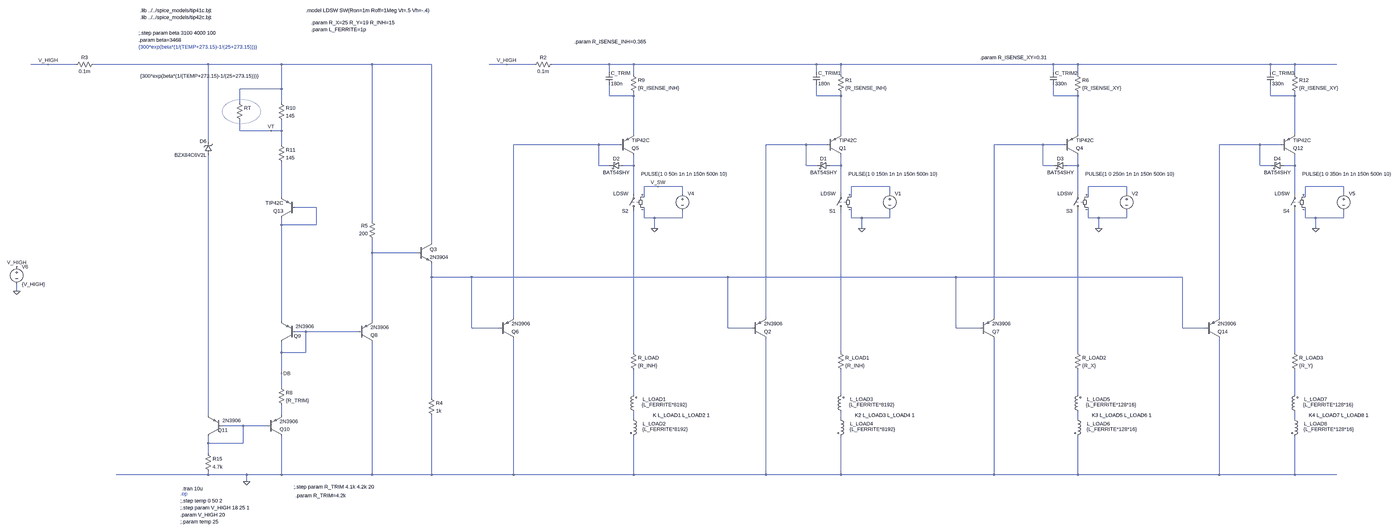
[diagram p0: schematic current_source.asc, whole sheet]
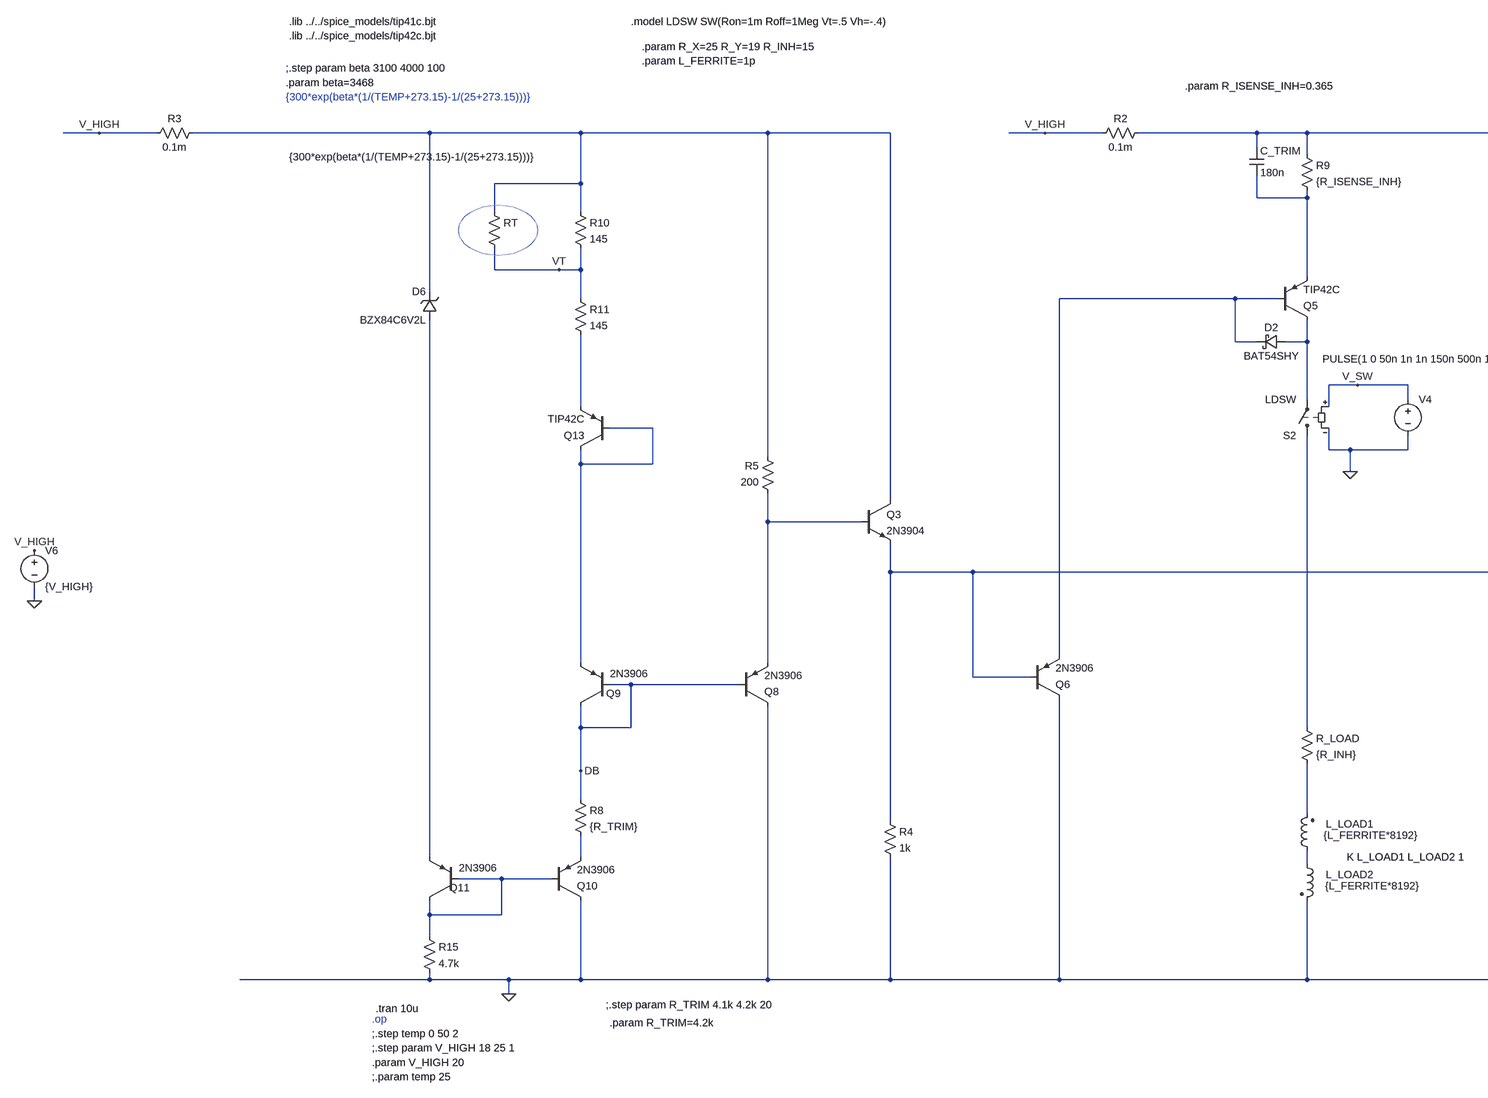
[diagram p1: schematic current_source.asc, part, row 1 of 1, column 1 of 2]
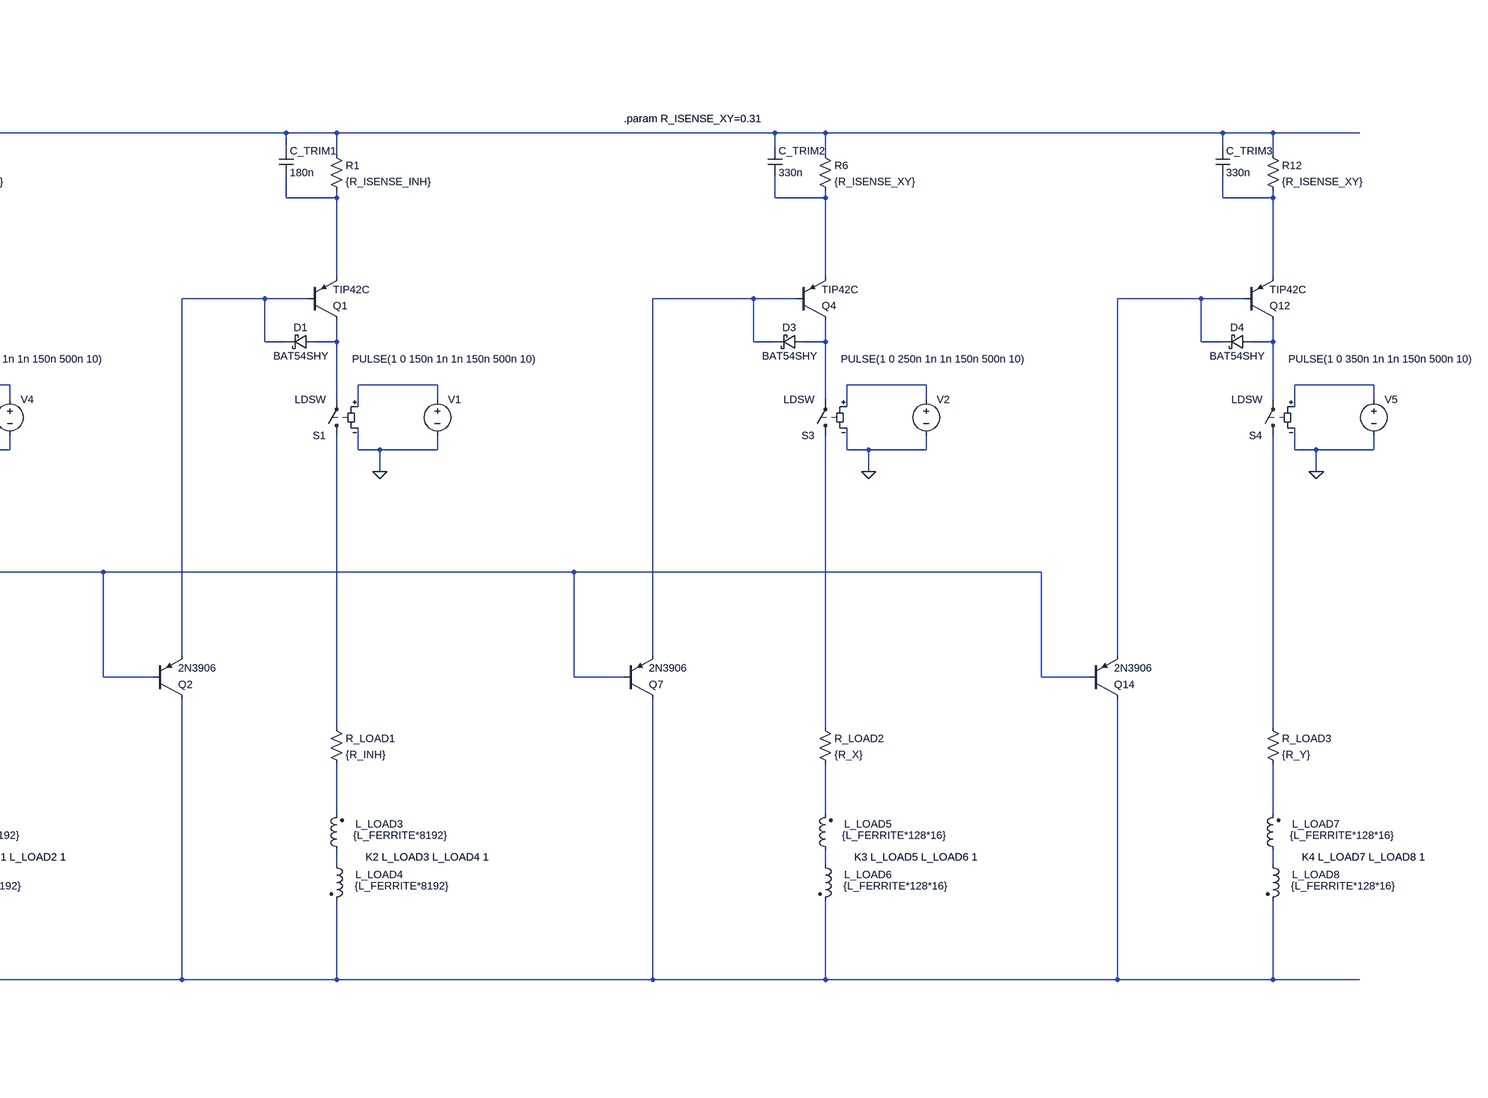
[diagram p2: schematic current_source.asc, part, row 1 of 1, column 2 of 2]
current_source.asc, the LTspice schematic file:
Version 4.1
SHEET 1 5384 1216
WIRE -1088 -3552 -1168 -3552
WIRE -960 -3552 -1088 -3552
WIRE -320 -3552 -880 -3552
WIRE 16 -3552 -320 -3552
WIRE 432 -3552 16 -3552
WIRE 704 -3552 432 -3552
WIRE 1088 -3552 1008 -3552
WIRE 1216 -3552 1088 -3552
WIRE 1584 -3552 1296 -3552
WIRE 1696 -3552 1584 -3552
WIRE 2608 -3552 1696 -3552
WIRE 2720 -3552 2608 -3552
WIRE 3728 -3552 2720 -3552
WIRE 3840 -3552 3728 -3552
WIRE 4800 -3552 3840 -3552
WIRE 4912 -3552 4800 -3552
WIRE 5104 -3552 4912 -3552
WIRE 1584 -3520 1584 -3552
WIRE 2608 -3520 2608 -3552
WIRE 3728 -3520 3728 -3552
WIRE 4800 -3520 4800 -3552
WIRE 1696 -3504 1696 -3552
WIRE 2720 -3504 2720 -3552
WIRE 3840 -3504 3840 -3552
WIRE 4912 -3504 4912 -3552
WIRE 16 -3440 16 -3552
WIRE 16 -3440 -176 -3440
WIRE 1584 -3408 1584 -3456
WIRE 1696 -3408 1696 -3424
WIRE 1696 -3408 1584 -3408
WIRE 2608 -3408 2608 -3456
WIRE 2720 -3408 2720 -3424
WIRE 2720 -3408 2608 -3408
WIRE 3728 -3408 3728 -3456
WIRE 3840 -3408 3840 -3424
WIRE 3840 -3408 3728 -3408
WIRE 4800 -3408 4800 -3456
WIRE 4912 -3408 4912 -3424
WIRE 4912 -3408 4800 -3408
WIRE -176 -3376 -176 -3440
WIRE 16 -3376 16 -3440
WIRE -176 -3248 -176 -3296
WIRE -32 -3248 -176 -3248
WIRE 16 -3248 16 -3296
WIRE 16 -3248 -32 -3248
WIRE 1696 -3232 1696 -3408
WIRE 2720 -3232 2720 -3408
WIRE 3840 -3232 3840 -3408
WIRE 4912 -3232 4912 -3408
WIRE -320 -3200 -320 -3552
WIRE 16 -3184 16 -3248
WIRE 1536 -3184 1120 -3184
WIRE 1632 -3184 1536 -3184
WIRE 2560 -3184 2336 -3184
WIRE 2656 -3184 2560 -3184
WIRE 3680 -3184 3456 -3184
WIRE 3776 -3184 3680 -3184
WIRE 4752 -3184 4528 -3184
WIRE 4848 -3184 4752 -3184
WIRE 1536 -3088 1536 -3184
WIRE 1584 -3088 1536 -3088
WIRE 1696 -3088 1696 -3136
WIRE 1696 -3088 1648 -3088
WIRE 2560 -3088 2560 -3184
WIRE 2608 -3088 2560 -3088
WIRE 2720 -3088 2720 -3136
WIRE 2720 -3088 2672 -3088
WIRE 3680 -3088 3680 -3184
WIRE 3728 -3088 3680 -3088
WIRE 3840 -3088 3840 -3136
WIRE 3840 -3088 3792 -3088
WIRE 4752 -3088 4752 -3184
WIRE 4800 -3088 4752 -3088
WIRE 4912 -3088 4912 -3136
WIRE 4912 -3088 4864 -3088
WIRE 1808 -2992 1744 -2992
WIRE 1920 -2992 1808 -2992
WIRE 2944 -2992 2768 -2992
WIRE 4064 -2992 3888 -2992
WIRE 5136 -2992 4960 -2992
WIRE 1696 -2960 1696 -3088
WIRE 1920 -2960 1920 -2992
WIRE 2720 -2960 2720 -3088
WIRE 2944 -2960 2944 -2992
WIRE 3840 -2960 3840 -3088
WIRE 4064 -2960 4064 -2992
WIRE 4912 -2960 4912 -3088
WIRE 5136 -2960 5136 -2992
WIRE 16 -2944 16 -3104
WIRE 1744 -2944 1744 -2992
WIRE 2768 -2944 2768 -2992
WIRE 3888 -2944 3888 -2992
WIRE 4960 -2944 4960 -2992
WIRE 176 -2896 80 -2896
WIRE 1744 -2848 1744 -2896
WIRE 1792 -2848 1744 -2848
WIRE 1920 -2848 1920 -2880
WIRE 1920 -2848 1792 -2848
WIRE 2768 -2848 2768 -2896
WIRE 2816 -2848 2768 -2848
WIRE 2944 -2848 2944 -2880
WIRE 2944 -2848 2816 -2848
WIRE 3888 -2848 3888 -2896
WIRE 3936 -2848 3888 -2848
WIRE 4064 -2848 4064 -2880
WIRE 4064 -2848 3936 -2848
WIRE 4960 -2848 4960 -2896
WIRE 5008 -2848 4960 -2848
WIRE 5136 -2848 5136 -2880
WIRE 5136 -2848 5008 -2848
WIRE 432 -2832 432 -3552
WIRE 16 -2816 16 -2848
WIRE 176 -2816 176 -2896
WIRE 176 -2816 16 -2816
WIRE 1792 -2800 1792 -2848
WIRE 2816 -2800 2816 -2848
WIRE 3936 -2800 3936 -2848
WIRE 5008 -2800 5008 -2848
WIRE 704 -2736 704 -3552
WIRE 432 -2688 432 -2752
WIRE 640 -2688 432 -2688
WIRE 704 -2576 704 -2640
WIRE 928 -2576 704 -2576
WIRE 2128 -2576 928 -2576
WIRE 3248 -2576 2128 -2576
WIRE 4320 -2576 3248 -2576
WIRE -1232 -2512 -1232 -2544
WIRE 1120 -2304 1120 -3184
WIRE 2336 -2304 2336 -3184
WIRE 3456 -2304 3456 -3184
WIRE 4528 -2304 4528 -3184
WIRE 16 -2288 16 -2816
WIRE 432 -2288 432 -2688
WIRE 928 -2256 928 -2576
WIRE 1056 -2256 928 -2256
WIRE 2128 -2256 2128 -2576
WIRE 2272 -2256 2128 -2256
WIRE 3248 -2256 3248 -2576
WIRE 3392 -2256 3248 -2256
WIRE 4320 -2256 4320 -2576
WIRE 4464 -2256 4320 -2256
WIRE 128 -2240 80 -2240
WIRE 368 -2240 128 -2240
WIRE 16 -2144 16 -2192
WIRE 128 -2144 128 -2240
WIRE 128 -2144 16 -2144
WIRE 1696 -2144 1696 -2880
WIRE 2720 -2144 2720 -2880
WIRE 3840 -2144 3840 -2880
WIRE 4912 -2144 4912 -2880
WIRE 16 -2048 16 -2144
WIRE 16 -1984 16 -2048
WIRE 1696 -1952 1696 -2064
WIRE 2720 -1952 2720 -2064
WIRE 3840 -1952 3840 -2064
WIRE 4912 -1952 4912 -2064
WIRE 704 -1936 704 -2576
WIRE -320 -1856 -320 -3136
WIRE 16 -1856 16 -1904
WIRE 1696 -1840 1696 -1872
WIRE 2720 -1840 2720 -1872
WIRE 3840 -1840 3840 -1872
WIRE 4912 -1840 4912 -1872
WIRE -160 -1808 -256 -1808
WIRE -48 -1808 -160 -1808
WIRE -320 -1728 -320 -1760
WIRE -160 -1728 -160 -1808
WIRE -160 -1728 -320 -1728
WIRE -320 -1680 -320 -1728
WIRE -320 -1584 -320 -1600
WIRE -320 -1584 -752 -1584
WIRE -144 -1584 -320 -1584
WIRE 16 -1584 16 -1760
WIRE 16 -1584 -144 -1584
WIRE 432 -1584 432 -2192
WIRE 432 -1584 16 -1584
WIRE 704 -1584 704 -1856
WIRE 704 -1584 432 -1584
WIRE 1120 -1584 1120 -2208
WIRE 1120 -1584 704 -1584
WIRE 1696 -1584 1696 -1760
WIRE 1696 -1584 1120 -1584
WIRE 2336 -1584 2336 -2208
WIRE 2336 -1584 1696 -1584
WIRE 2720 -1584 2720 -1760
WIRE 2720 -1584 2336 -1584
WIRE 3456 -1584 3456 -2208
WIRE 3456 -1584 2720 -1584
WIRE 3840 -1584 3840 -1760
WIRE 3840 -1584 3456 -1584
WIRE 4528 -1584 4528 -2208
WIRE 4528 -1584 3840 -1584
WIRE 4912 -1584 4912 -1760
WIRE 4912 -1584 4528 -1584
WIRE 5104 -1584 4912 -1584
WIRE -144 -1552 -144 -1584
FLAG -144 -1552 0
FLAG -32 -3248 VT
FLAG 16 -2048 DB
FLAG 1792 -2800 0
FLAG 1808 -2992 V_SW
FLAG 2816 -2800 0
FLAG 3936 -2800 0
FLAG 5008 -2800 0
FLAG 1088 -3552 V_HIGH
FLAG -1088 -3552 V_HIGH
FLAG -1232 -2512 0
FLAG -1232 -2624 V_HIGH
SYMBOL res 0 -2000 R0
SYMATTR InstName R8
SYMATTR Value {R_TRIM}
SYMBOL res 1680 -3520 R0
SYMATTR InstName R9
SYMATTR Value {R_ISENSE_INH}
SYMBOL pnp 1632 -3136 M180
SYMATTR InstName Q5
SYMATTR Value TIP42C
SYMBOL pnp 368 -2192 M180
SYMATTR InstName Q8
SYMATTR Value 2N3906
SYMBOL pnp 80 -2192 R180
WINDOW 0 -25 28 Left 2
WINDOW 3 -86 72 Left 2
SYMATTR InstName Q9
SYMATTR Value 2N3906
SYMBOL res 0 -3392 R0
SYMATTR InstName R10
SYMATTR Value 145
SYMBOL res 0 -3200 R0
SYMATTR InstName R11
SYMATTR Value 145
SYMBOL res -192 -3392 R0
WINDOW 3 -440 -107 Left 2
SYMATTR Value {300*exp(beta*(1/(TEMP+273.15)-1/(25+273.15)))}
SYMATTR InstName RT
SYMBOL schottky 1648 -3104 R90
WINDOW 0 0 32 VBottom 2
WINDOW 3 32 32 VTop 2
SYMATTR InstName D2
SYMATTR Value BAT54SHY
SYMATTR Description Diode
SYMATTR Type diode
SYMBOL cap 1568 -3520 R0
SYMATTR InstName C_TRIM
SYMATTR Value 180n
SYMBOL zener -304 -3136 R180
WINDOW 0 24 64 Left 2
WINDOW 3 24 0 Left 2
SYMATTR InstName D6
SYMATTR Value BZX84C6V2L
SYMBOL res -336 -1696 R0
SYMATTR InstName R15
SYMATTR Value 4.7k
SYMBOL pnp -48 -1760 M180
SYMATTR InstName Q10
SYMATTR Value 2N3906
SYMBOL pnp -256 -1760 R180
WINDOW 0 -25 28 Left 2
WINDOW 3 -86 72 Left 2
SYMATTR InstName Q11
SYMATTR Value 2N3906
SYMBOL sw 1696 -2864 R180
SYMATTR InstName S2
SYMATTR Value LDSW
SYMBOL voltage 1920 -2976 R0
WINDOW 123 0 0 Left 0
WINDOW 39 0 0 Left 0
WINDOW 3 -190 -74 Left 2
SYMATTR Value PULSE(1 0 50n 1n 1n 150n 500n 10)
SYMATTR InstName V4
SYMBOL res 1680 -2160 R0
SYMATTR InstName R_LOAD
SYMATTR Value {R_INH}
SYMBOL ind2 1712 -1856 R180
WINDOW 0 -26 74 Right 2
WINDOW 3 -21 49 Right 2
SYMATTR InstName L_LOAD1
SYMATTR Value {L_FERRITE*8192}
SYMATTR Type ind
SYMBOL ind2 1680 -1856 R0
WINDOW 0 58 39 Left 2
WINDOW 3 56 64 Left 2
SYMATTR InstName L_LOAD2
SYMATTR Value {L_FERRITE*8192}
SYMATTR Type ind
SYMBOL res 2704 -3520 R0
SYMATTR InstName R1
SYMATTR Value {R_ISENSE_INH}
SYMBOL pnp 2656 -3136 M180
SYMATTR InstName Q1
SYMATTR Value TIP42C
SYMBOL pnp 2272 -2208 M180
SYMATTR InstName Q2
SYMATTR Value 2N3906
SYMBOL schottky 2672 -3104 R90
WINDOW 0 0 32 VBottom 2
WINDOW 3 32 32 VTop 2
SYMATTR InstName D1
SYMATTR Value BAT54SHY
SYMATTR Description Diode
SYMATTR Type diode
SYMBOL cap 2592 -3520 R0
SYMATTR InstName C_TRIM1
SYMATTR Value 180n
SYMBOL sw 2720 -2864 R180
SYMATTR InstName S1
SYMATTR Value LDSW
SYMBOL voltage 2944 -2976 R0
WINDOW 123 0 0 Left 0
WINDOW 39 0 0 Left 0
WINDOW 3 -190 -74 Left 2
SYMATTR Value PULSE(1 0 150n 1n 1n 150n 500n 10)
SYMATTR InstName V1
SYMBOL res 2704 -2160 R0
SYMATTR InstName R_LOAD1
SYMATTR Value {R_INH}
SYMBOL ind2 2736 -1856 R180
WINDOW 0 -26 74 Right 2
WINDOW 3 -21 49 Right 2
SYMATTR InstName L_LOAD3
SYMATTR Value {L_FERRITE*8192}
SYMATTR Type ind
SYMBOL ind2 2704 -1856 R0
WINDOW 0 58 39 Left 2
WINDOW 3 56 64 Left 2
SYMATTR InstName L_LOAD4
SYMATTR Value {L_FERRITE*8192}
SYMATTR Type ind
SYMBOL npn 640 -2736 R0
SYMATTR InstName Q3
SYMATTR Value 2N3904
SYMBOL pnp 1056 -2208 M180
SYMATTR InstName Q6
SYMATTR Value 2N3906
SYMBOL res 688 -1952 R0
SYMATTR InstName R4
SYMATTR Value 1k
SYMBOL pnp 80 -2848 R180
SYMATTR InstName Q13
SYMATTR Value TIP42C
SYMBOL res 448 -2736 R180
WINDOW 0 36 76 Left 2
WINDOW 3 36 40 Left 2
SYMATTR InstName R5
SYMATTR Value 200
SYMBOL res 3824 -3520 R0
SYMATTR InstName R6
SYMATTR Value {R_ISENSE_XY}
SYMBOL pnp 3776 -3136 M180
SYMATTR InstName Q4
SYMATTR Value TIP42C
SYMBOL pnp 3392 -2208 M180
SYMATTR InstName Q7
SYMATTR Value 2N3906
SYMBOL schottky 3792 -3104 R90
WINDOW 0 0 32 VBottom 2
WINDOW 3 32 32 VTop 2
SYMATTR InstName D3
SYMATTR Value BAT54SHY
SYMATTR Description Diode
SYMATTR Type diode
SYMBOL cap 3712 -3520 R0
SYMATTR InstName C_TRIM2
SYMATTR Value 330n
SYMBOL sw 3840 -2864 R180
SYMATTR InstName S3
SYMATTR Value LDSW
SYMBOL voltage 4064 -2976 R0
WINDOW 123 0 0 Left 0
WINDOW 39 0 0 Left 0
WINDOW 3 -190 -74 Left 2
SYMATTR Value PULSE(1 0 250n 1n 1n 150n 500n 10)
SYMATTR InstName V2
SYMBOL res 3824 -2160 R0
SYMATTR InstName R_LOAD2
SYMATTR Value {R_X}
SYMBOL ind2 3856 -1856 R180
WINDOW 0 -26 74 Right 2
WINDOW 3 -21 49 Right 2
SYMATTR InstName L_LOAD5
SYMATTR Value {L_FERRITE*128*16}
SYMATTR Type ind
SYMBOL ind2 3824 -1856 R0
WINDOW 0 58 39 Left 2
WINDOW 3 56 64 Left 2
SYMATTR InstName L_LOAD6
SYMATTR Value {L_FERRITE*128*16}
SYMATTR Type ind
SYMBOL res 4896 -3520 R0
SYMATTR InstName R12
SYMATTR Value {R_ISENSE_XY}
SYMBOL pnp 4848 -3136 M180
SYMATTR InstName Q12
SYMATTR Value TIP42C
SYMBOL pnp 4464 -2208 M180
SYMATTR InstName Q14
SYMATTR Value 2N3906
SYMBOL schottky 4864 -3104 R90
WINDOW 0 0 32 VBottom 2
WINDOW 3 32 32 VTop 2
SYMATTR InstName D4
SYMATTR Value BAT54SHY
SYMATTR Description Diode
SYMATTR Type diode
SYMBOL cap 4784 -3520 R0
SYMATTR InstName C_TRIM3
SYMATTR Value 330n
SYMBOL sw 4912 -2864 R180
SYMATTR InstName S4
SYMATTR Value LDSW
SYMBOL voltage 5136 -2976 R0
WINDOW 123 0 0 Left 0
WINDOW 39 0 0 Left 0
WINDOW 3 -190 -74 Left 2
SYMATTR Value PULSE(1 0 350n 1n 1n 150n 500n 10)
SYMATTR InstName V5
SYMBOL res 4896 -2160 R0
SYMATTR InstName R_LOAD3
SYMATTR Value {R_Y}
SYMBOL ind2 4928 -1856 R180
WINDOW 0 -26 74 Right 2
WINDOW 3 -21 49 Right 2
SYMATTR InstName L_LOAD7
SYMATTR Value {L_FERRITE*128*16}
SYMATTR Type ind
SYMBOL ind2 4896 -1856 R0
WINDOW 0 58 39 Left 2
WINDOW 3 56 64 Left 2
SYMATTR InstName L_LOAD8
SYMATTR Value {L_FERRITE*128*16}
SYMATTR Type ind
SYMBOL res 1200 -3536 R270
WINDOW 0 32 56 VTop 2
WINDOW 3 0 56 VBottom 2
SYMATTR InstName R2
SYMATTR Value 0.1m
SYMBOL res -976 -3536 R270
WINDOW 0 32 56 VTop 2
WINDOW 3 0 56 VBottom 2
SYMATTR InstName R3
SYMATTR Value 0.1m
SYMBOL voltage -1232 -2640 R0
SYMATTR InstName V6
SYMATTR Value {V_HIGH}
TEXT -632 -3768 Left 2 !.lib ../../spice_models/tip42c.bjt
TEXT -632 -3800 Left 2 !.lib ../../spice_models/tip41c.bjt
TEXT -448 -1464 Left 2 !;.step temp 0 50 2
TEXT -448 -1496 Left 2 ;.op
TEXT -448 -1432 Left 2 !;.step param V_HIGH 18 25 1
TEXT -640 -3664 Left 2 !.param beta=3468
TEXT -640 -3696 Left 2 !;.step param beta 3100 4000 100
TEXT -640 -3632 Left 2 ;{300*exp(beta*(1/(TEMP+273.15)-1/(25+273.15)))}
TEXT 152 -3712 Left 2 !.param L_FERRITE=1p
TEXT 152 -3744 Left 2 !.param R_X=25 R_Y=19 R_INH=15
TEXT 1424 -3656 Left 2 !.param R_ISENSE_INH=0.365
TEXT 72 -1528 Left 2 !;.step param R_TRIM 4.1k 4.2k 20
TEXT 80 -1488 Left 2 !.param R_TRIM=4.2k
TEXT -448 -1400 Left 2 !.param V_HIGH 20
TEXT -448 -1368 Left 2 !;.param temp 25
TEXT 1784 -1856 Left 2 !K L_LOAD1 L_LOAD2 1
TEXT 128 -3800 Left 2 !.model LDSW SW(Ron=1m Roff=1Meg Vt=.5 Vh=-.4)
TEXT -440 -1520 Left 2 !.tran 10u
TEXT 2784 -1856 Left 2 !K2 L_LOAD3 L_LOAD4 1
TEXT 3904 -1856 Left 2 !K3 L_LOAD5 L_LOAD6 1
TEXT 4976 -1856 Left 2 !K4 L_LOAD7 L_LOAD8 1
TEXT 3392 -3584 Left 2 !.param R_ISENSE_XY=0.31
CIRCLE Normal -80 -3280 -256 -3392 2

The netlist it stands for:
* current_source.asc
R8 DB N031 {R_TRIM}
R9 N002 N003 {R_ISENSE_INH}
Q5 N011 N007 N003 0 TIP42C
Q8 0 DB N020 0 2N3906
Q9 DB DB N019 0 2N3906
R10 N001 VT 145
R11 VT N018 145
RT N001 VT {300*exp(beta*(1/(TEMP+273.15)-1/(25+273.15)))}
D2 N011 N007 BAT54SHY
C_TRIM N002 N003 180n
D6 N030 N001 BZX84C6V2L
R15 N036 0 4.7k
Q10 0 N036 N031 0 2N3906
Q11 N036 N036 N030 0 2N3906
S2 N022 N011 V_SW 0 LDSW
V4 V_SW 0 PULSE(1 0 50n 1n 1n 150n 500n 10)
R_LOAD N022 N026 {R_INH}
L_LOAD1 N032 N026 {L_FERRITE*8192}
L_LOAD2 N032 0 {L_FERRITE*8192}
R1 N002 N004 {R_ISENSE_INH}
Q1 N012 N008 N004 0 TIP42C
Q2 0 N021 N008 0 2N3906
D1 N012 N008 BAT54SHY
C_TRIM1 N002 N004 180n
S1 N023 N012 N015 0 LDSW
V1 N015 0 PULSE(1 0 150n 1n 1n 150n 500n 10)
R_LOAD1 N023 N027 {R_INH}
L_LOAD3 N033 N027 {L_FERRITE*8192}
L_LOAD4 N033 0 {L_FERRITE*8192}
Q3 N001 N020 N021 0 2N3904
Q6 0 N021 N007 0 2N3906
R4 N021 0 1k
Q13 N019 N019 N018 0 TIP42C
R5 N020 N001 200
R6 N002 N005 {R_ISENSE_XY}
Q4 N013 N009 N005 0 TIP42C
Q7 0 N021 N009 0 2N3906
D3 N013 N009 BAT54SHY
C_TRIM2 N002 N005 330n
S3 N024 N013 N016 0 LDSW
V2 N016 0 PULSE(1 0 250n 1n 1n 150n 500n 10)
R_LOAD2 N024 N028 {R_X}
L_LOAD5 N034 N028 {L_FERRITE*128*16}
L_LOAD6 N034 0 {L_FERRITE*128*16}
R12 N002 N006 {R_ISENSE_XY}
Q12 N014 N010 N006 0 TIP42C
Q14 0 N021 N010 0 2N3906
D4 N014 N010 BAT54SHY
C_TRIM3 N002 N006 330n
S4 N025 N014 N017 0 LDSW
V5 N017 0 PULSE(1 0 350n 1n 1n 150n 500n 10)
R_LOAD3 N025 N029 {R_Y}
L_LOAD7 N035 N029 {L_FERRITE*128*16}
L_LOAD8 N035 0 {L_FERRITE*128*16}
R2 V_HIGH N002 0.1m
R3 V_HIGH N001 0.1m
V6 V_HIGH 0 {V_HIGH}
.model D D
.lib standard.dio
.model NPN NPN
.model PNP PNP
.lib standard.bjt
.lib ../../spice_models/tip42c.bjt
.lib ../../spice_models/tip41c.bjt
;.step temp 0 50 2
* .op
;.step param V_HIGH 18 25 1
.param beta=3468
;.step param beta 3100 4000 100
* {300*exp(beta*(1/(TEMP+273.15)-1/(25+273.15)))}
.param L_FERRITE=1p
.param R_X=25 R_Y=19 R_INH=15
.param R_ISENSE_INH=0.365
;.step param R_TRIM 4.1k 4.2k 20
.param R_TRIM=4.2k
.param V_HIGH 20
;.param temp 25
K L_LOAD1 L_LOAD2 1
.model LDSW SW(Ron=1m Roff=1Meg Vt=.5 Vh=-.4)
.tran 10u
K2 L_LOAD3 L_LOAD4 1
K3 L_LOAD5 L_LOAD6 1
K4 L_LOAD7 L_LOAD8 1
.param R_ISENSE_XY=0.31
.backanno
.end